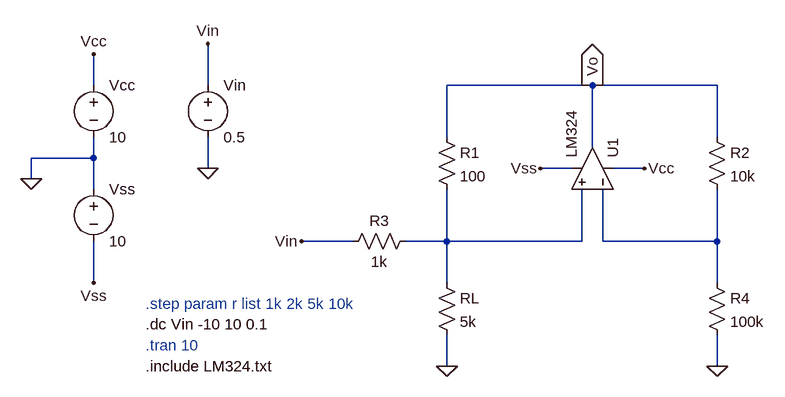
[diagram p0: schematic TP1_2.asc]
TP1_2.asc, the LTspice schematic file:
Version 4
SHEET 1 880 680
WIRE -400 -96 -400 -144
WIRE -224 -96 -224 -160
WIRE 368 -96 144 -96
WIRE 560 -96 368 -96
WIRE 144 -16 144 -96
WIRE 560 -16 560 -96
WIRE 368 0 368 -96
WIRE -400 16 -400 -16
WIRE -400 16 -496 16
WIRE -224 32 -224 -16
WIRE 336 32 288 32
WIRE 448 32 400 32
WIRE -496 48 -496 16
WIRE -400 64 -400 16
WIRE 0 144 -80 144
WIRE 144 144 144 64
WIRE 144 144 80 144
WIRE 352 144 352 64
WIRE 352 144 144 144
WIRE 384 144 384 64
WIRE 560 144 560 64
WIRE 560 144 384 144
WIRE -400 208 -400 144
WIRE 144 208 144 144
WIRE 560 208 560 144
WIRE 144 336 144 288
WIRE 560 336 560 288
FLAG -496 48 0
FLAG -400 -144 Vcc
FLAG -400 208 Vss
FLAG 448 32 Vcc
FLAG 288 32 Vss
FLAG 144 336 0
FLAG 560 336 0
FLAG -224 32 0
FLAG -224 -160 Vin
FLAG -80 144 Vin
FLAG 368 -96 Vo
IOPIN 368 -96 Out
SYMBOL OpAmps\\opamp2 432 32 M270
SYMATTR InstName U1
SYMATTR Value LM324
SYMBOL voltage -400 48 R0
WINDOW 123 0 0 Left 0
WINDOW 39 0 0 Left 0
SYMATTR InstName Vss
SYMATTR Value 10
SYMBOL voltage -400 -112 R0
WINDOW 123 0 0 Left 0
WINDOW 39 0 0 Left 0
SYMATTR InstName Vcc
SYMATTR Value 10
SYMBOL res 128 -32 R0
SYMATTR InstName R1
SYMATTR Value 100
SYMBOL res 544 -32 R0
SYMATTR InstName R2
SYMATTR Value 10k
SYMBOL res 96 128 R90
WINDOW 0 0 56 VBottom 2
WINDOW 3 32 56 VTop 2
SYMATTR InstName R3
SYMATTR Value 1k
SYMBOL res 544 192 R0
SYMATTR InstName R4
SYMATTR Value 100k
SYMBOL res 128 192 R0
SYMATTR InstName RL
SYMATTR Value 5k
SYMBOL voltage -224 -112 R0
WINDOW 123 0 0 Left 0
WINDOW 39 0 0 Left 0
SYMATTR InstName Vin
SYMATTR Value 0.5
TEXT -320 272 Left 2 !.dc Vin -10 10 0.1
TEXT -320 336 Left 2 !.include LM324.txt
TEXT -320 240 Left 2 ;.step param r list 1k 2k 5k 10k
TEXT -320 304 Left 2 ;.tran 10

The netlist it stands for:
* TP1_2.asc
XU1 N001 N002 Vcc Vss Vo LM324  ; pins In+ In- V+ V- OUT
Vss 0 Vss 10
Vcc Vcc 0 10
R1 Vo N001 100
R2 Vo N002 10k
R3 N001 Vin 1k
R4 N002 0 100k
RL N001 0 5k
Vin Vin 0 0.5
.dc Vin -10 10 0.1
.include LM324.txt
* .step param r list 1k 2k 5k 10k
* .tran 10
.backanno
.end